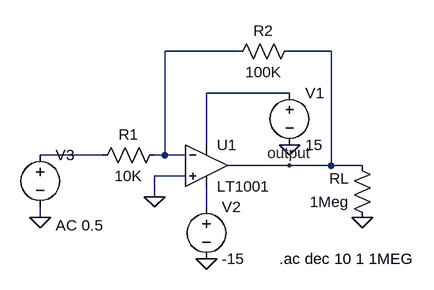
[diagram p0: schematic t3a.asc]
t3a.asc, the LTspice schematic file:
Version 4
SHEET 1 880 680
WIRE 224 -32 112 -32
WIRE 368 -32 304 -32
WIRE 304 32 176 32
WIRE 176 112 176 32
WIRE 16 128 -80 128
WIRE 112 128 112 -32
WIRE 112 128 96 128
WIRE 144 128 112 128
WIRE 304 144 208 144
WIRE 368 144 368 -32
WIRE 368 144 304 144
WIRE 416 144 368 144
WIRE 144 160 96 160
WIRE 96 192 96 160
WIRE 176 208 176 176
WIRE -80 224 -80 208
FLAG -80 224 0
FLAG 416 224 0
FLAG 304 112 0
FLAG 176 288 0
FLAG 96 192 0
FLAG 304 144 output
SYMBOL res 112 112 R90
WINDOW 0 0 56 VBottom 2
WINDOW 3 32 56 VTop 2
SYMATTR InstName R1
SYMATTR Value 10K
SYMBOL res 320 -48 R90
WINDOW 0 0 56 VBottom 2
WINDOW 3 32 56 VTop 2
SYMATTR InstName R2
SYMATTR Value 100K
SYMBOL res 432 240 R180
WINDOW 0 36 76 Left 2
WINDOW 3 36 40 Left 2
SYMATTR InstName RL
SYMATTR Value 1Meg
SYMBOL voltage 304 16 R0
WINDOW 123 0 0 Left 2
WINDOW 39 0 0 Left 2
SYMATTR InstName V1
SYMATTR Value 15
SYMBOL voltage 176 192 R0
WINDOW 123 0 0 Left 2
WINDOW 39 0 0 Left 2
SYMATTR InstName V2
SYMATTR Value -15
SYMBOL voltage -80 112 R0
WINDOW 123 24 124 Left 2
WINDOW 39 0 0 Left 2
SYMATTR InstName V3
SYMATTR Value ""
SYMATTR Value2 AC 0.5
SYMBOL Opamps\\LT1001 176 80 R0
SYMATTR InstName U1
TEXT 288 288 Left 2 !.ac dec 10 1 1MEG

The netlist it stands for:
* t3a.asc
R1 N001 N003 10K
R2 output N001 100K
RL 0 output 1Meg
V1 N002 0 15
V2 N004 0 -15
V3 N003 0 AC 0.5
XU1 0 N001 N002 N004 output LT1001  ; pins In+ In- V+ V- OUT
.ac dec 10 1 1MEG
.lib LTC.lib
.backanno
.end